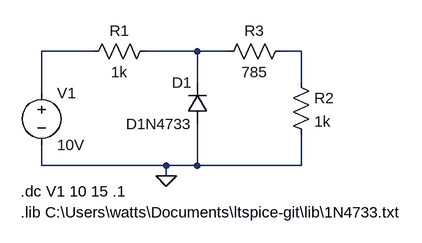
[diagram p0: schematic Diode_1N4733_voltage_reference.asc]
Diode_1N4733_voltage_reference.asc, the LTspice schematic file:
Version 4
SHEET 1 880 680
WIRE 112 112 32 112
WIRE 272 112 192 112
WIRE 320 112 272 112
WIRE 432 112 400 112
WIRE 272 160 272 112
WIRE 432 160 432 112
WIRE 32 176 32 112
WIRE 32 288 32 256
WIRE 224 288 32 288
WIRE 272 288 272 224
WIRE 272 288 224 288
WIRE 432 288 432 240
WIRE 432 288 272 288
WIRE 224 304 224 288
FLAG 224 304 0
SYMBOL diode 288 224 R180
WINDOW 0 24 64 Left 2
WINDOW 3 24 0 Left 2
SYMATTR InstName D1
SYMATTR Value D1N4733
SYMBOL voltage 32 160 R0
SYMATTR InstName V1
SYMATTR Value 10V
SYMBOL res 208 96 R90
WINDOW 0 0 56 VBottom 2
WINDOW 3 32 56 VTop 2
SYMATTR InstName R1
SYMATTR Value 1k
SYMBOL res 416 144 R0
SYMATTR InstName R2
SYMATTR Value 1k
SYMBOL res 416 96 R90
WINDOW 0 0 56 VBottom 2
WINDOW 3 32 56 VTop 2
SYMATTR InstName R3
SYMATTR Value 785
TEXT 0 328 Left 2 !.dc V1 10 15 .1
TEXT 0 360 Left 2 !.lib C:\\Users\\watts\\Documents\\ltspice-git\\lib\\1N4733.txt

The netlist it stands for:
* Diode_1N4733_voltage_reference.asc
D1 0 N002 D1N4733
V1 N001 0 10V
R1 N002 N001 1k
R2 N003 0 1k
R3 N003 N002 785
.model D D
.lib standard.dio
.dc V1 10 15 .1
.lib C:\Users\watts\Documents\ltspice-git\lib\1N4733.txt
.backanno
.end